# Altium project c195-group-9-vocast-pcb.PrjPcb (part 1 of 2)
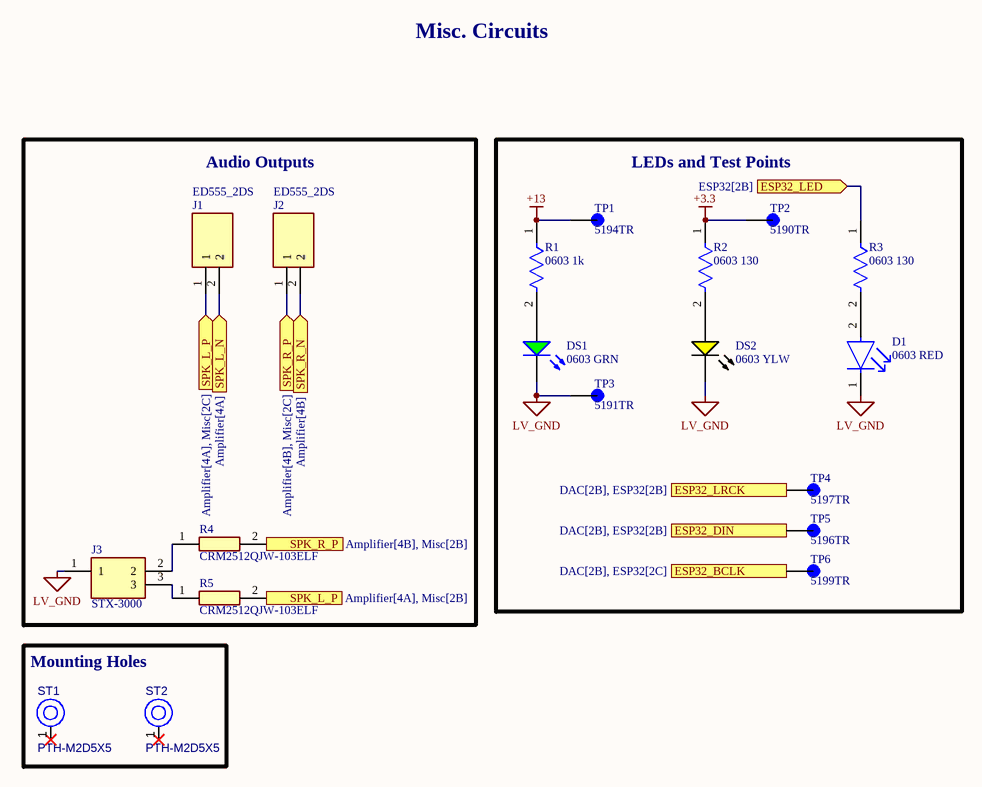
[diagram p0: Misc.SchDoc]
5 sheets, 141 parts. Net scope: flat (ports and power ports of the same name join across sheets).
Board file: Basestation.PcbDoc
Sheets:
  Misc.SchDoc
  Power.SchDoc
  ESP32.SchDoc
  DAC.SchDoc
  Amplifier.SchDoc

## Sheet Misc.SchDoc
size A; SheetNumber: 1; SheetTotal: 5

### Parts
D1  0603 RED  [FP-SML-LX0603IW-TR-MFG]
DS1  0603 GRN  [LUMX-SML-LX0603_V]
DS2  0603 YLW  [LUMX-SML-LX0603_V]
J1  ED555_2DS  [SHDR2W90P0X350_1X2_700X650X820P]
J2  ED555_2DS  [SHDR2W90P0X350_1X2_700X650X820P]
J3  STX-3000  [STX3000]
R1  0603 1k  [FP-CRCW0603-e3-MFG]
R2  0603 130  [FP-CRCW0603-e3-MFG]
R3  0603 130  [FP-CRCW0603-e3-MFG]
R4  CRM2512QJW-103ELF  [RESC6331X80N]
R5  CRM2512QJW-103ELF  [RESC6331X80N]
ST1  PTH-M2D5X5  [PTH-M2D5X5]
ST2  PTH-M2D5X5  [PTH-M2D5X5]
TP1  5194TR  [KEYSTONE_5194TR]
TP2  5190TR  [KEYSTONE_5190TR]
TP3  5191TR  [KEYSTONE_5191TR]
TP4  5197TR  [KEYSTONE_5197TR]
TP5  5196TR  [KEYSTONE_5196TR]
TP6  5199TR  [KEYSTONE_5199TR]

### Blocks framed on the sheet
Audio Outputs: J1-J3 R4 R5
LEDs and Test Points: D1 DS1 DS2 R1-R3 TP1-TP6
Mounting Holes: ST1 ST2

### Ports
ESP32_BCLK (see DAC[2B], ESP32[2C]), ESP32_DIN (see DAC[2B], ESP32[2B]), ESP32_LED (in, see ESP32[2B]), ESP32_LRCK (see DAC[2B], ESP32[2B]), SPK_L_N (in, see Amplifier[4A]), SPK_L_P (in, see Amplifier[4A], Misc[2B]), SPK_L_P (in, see Amplifier[4A], Misc[2C]), SPK_R_N (in, see Amplifier[4B]), SPK_R_P (in, see Amplifier[4B], Misc[2B]), SPK_R_P (in, see Amplifier[4B], Misc[2C])

### Nets
+3.3: R2.1 TP2.TP
+13: R1.1 TP1.TP  [project net TPA311_PVCCL]
LV_GND: D1.1(C) DS1.2(K) DS2.2(K) J3.1 TP3.TP  [project net TPA311_AGND]
NetC4_1: J1.1 R5.2 ; port SPK_L_P
NetC7_2: J1.2 ; port SPK_L_N
NetC10_1: J2.1 R4.2 ; port SPK_R_P
NetC11_2: J2.2 ; port SPK_R_N
NetD1_2: D1.2(A) R3.2
NetDS1_1: DS1.1(A) R1.2
NetDS2_1: DS2.1(A) R2.2
NetIC1_20: R3.1 ; port ESP32_LED
NetIC1_22: TP4.TP ; port ESP32_LRCK
NetIC1_23: TP5.TP ; port ESP32_DIN
NetIC1_24: TP6.TP ; port ESP32_BCLK
NetJ3_2: J3.2 R4.1
NetJ3_3: J3.3 R5.1

Not connected (* = marked no-connect by the designer): ST1 1(H1)*; ST2 1(H1)*

### Notes on the sheet
- Misc. Circuits

### Library data of the parts
D1 = CMP-57192-000012-1: LED RED DIFFUSED SMD; Luminous Intensity: 14mcd; Test Current: 20mA; Viewing Angle: 160°; Approvals: UL; Forward Voltage: 2V; Power Dissipation: 50mW; Dominant Wavelength: 635nm; Number of LEDs: 1; Lens Color: White; Height: 0.6mm; RoHS Compliant: Yes; Lead Free: Lead Free; Number of Pins: 2; Packaging: Tape and Reel; Case/Package: 0603; Length: 1.6mm; Color: Red; Max Operating Temperature: 85°C; Illumination Color: Red; Case Code (Metric): 1608; Diameter: 0.061inch; Min Operating Temperature: -25°C; Lens Style: Diffused; Mount: Surface Mount; Width: 0.8mm; Case Code (Imperial): 0603; Lens Transparency: Diffused; Wavelength: 635nm; Package Quantity: 1; Forward Current: 20mA
DS1 = CMP-2000-07120-1: LED Green Diode, 18 mcd, 50 mW, -25 to 85 degC, 2-Pin SMD, RoHS, Tape and Reel; Manufacturer: Lumex; Part No: SML-LX0603GW-TR; Peak Wavelength: 565nm; Viewing Angle: 160; LED Material: GaP; COO: CN; Lens Appearance: ColorlessDiffused; Pin_Count: 2; Type: Uni-Color; Intensity: 18mcd; Number of LEDs: 1; Reverse Voltage: 5(Min)V; Supplier: Lumex; ECCN: EAR99; Packaging: TapeandReel; Supplier Standard Pack: 4,000; Mounting: SurfaceMount; Operating Temperature: -25to85C; Package Description: 2-Pin Surface Mount Device, Body 1.6 x 0.8 mm; Family: SML-LX0603GW; Lens Dimensions: 1x0.8x0.3mm; Dominant Wavelength: N/A; Package Reference: SML-LX00603; HTS: 8541402000; Mounting Technology: SurfaceMount; Datasheet Version: Rev. G, 09/2013; Manufacturer URL: http://www.lumexinstruments.com/; RoHS: Yes; Datasheet URL: http://www.lumex.com/content/files/ProductAttachment/SML-LX0603GW-TR.pdf; Supplier_Package: SMD; Color: Green; Dimension: 1.6x0.8x0.6mm
DS2 = CMP-2000-07121-1: Yellow LED, Milky White Diffused Lens, 2.1 V, 14 mcd, -25 to 85 degC, 2-Pin SMD, RoHS, Tape and Reel; Manufacturer: Lumex; Part No: SML-LX0603YW-TR; COO: CN; Number of LEDs: 1; Type: Uni-Color; Intensity: 14mcd; Reverse Voltage: 5(Min)V; LED Material: GaAsP; Viewing Angle: 160; Peak Wavelength: 585nm; Pin_Count: 2; Lens Appearance: ColorlessDiffused; Operating Temperature: -25to85C; Color: Yellow; Mounting Technology: SurfaceMount; Package Description: 2-Pin Surface Mount Device, Body 1.6 x 0.8 mm; Mounting: SurfaceMount; Packaging: TapeandReel; RoHS: Unknown; Supplier_Package: SMD; Package Reference: SML-LX00603; Datasheet URL: http://www.lumex.com/content/files/ProductAttachment/SML-LX0603YW-TR.pdf; Dimension: 1.6x0.8x0.6mm; Manufacturer URL: http://www.lumexinstruments.com/; HTS: 8541402000; Datasheet Version: Rev. G, 09/2013; Lens Dimensions: 1x0.8x0.3mm; Dominant Wavelength: N/A; ECCN: EARII; Supplier: Lumex; Family: SML-LX0603YW
J1 J2 = ED555_2DS: Connector; Manufacturer_Name: On Shore Technology Inc.; Manufacturer_Part_Number: ED555/2DS; Datasheet Link: http://www.on-shore.com/wp-content/uploads/ED555XDS.pdf; Height: 8.2mm; Arrow Part Number: ED555/2DS; Arrow Price/Stock: https://www.arrow.com/en/products/ed5552ds/on-shore-technology?utm_currency=USD&region=nac
J3 = STX-3000: Connector; Manufacturer_Name: Kycon; Datasheet Link: http://www.kycon.com/Pub_Eng_Draw/STX-3000.pdf; Manufacturer_Part_Number: STX-3000; Mouser Part Number: 806-STX-3000; Mouser Price/Stock: https://www.mouser.co.uk/ProductDetail/Kycon/STX-3000?qs=kjZ2mQLP346Nbz1X9BOzfg%3D%3D
R1 = CMP-1666-00003-5: RES Thick Film, 1kΩ, 1%, 0.1W, 100ppm/°C, 0603; Max Power Dissipation: 100mW; Voltage Rating: 75V; Resistance: 1kR; Max Operating Temperature: 155°C; Number of Pins: 2; Case Code (Imperial): 0603; Width: 0.033inch; Power Rating: 100mW; Number of Terminations: 2; Package Quantity: 10; Weight: 7.1E-05oz; Tolerance: 1%; Temperature Coefficient: 100ppm/°C; Military Standard: Not; Mount: Surface Mount; Voltage Rating (DC): 75V; Depth: 0.85mm; Composition: Thick Film; Radiation Hardening: No; Termination: SMD/SMT; Length: 1.55mm; Case Code (Metric): 1608; Contact Plating: Tin; Min Operating Temperature: -55°C; Packaging: Tape and Reel; Height: 0.45mm; Lead Free: Lead Free; Case/Package: 0603; Features: Automotive AEC-Q200
R2 R3 = CMP-2000-03889-2: RES Thick Film, 130Ω, 1%, 0.1W, 100ppm/°C, 0603; Working Voltage: 75V; Power Rating: 100mW; Resistance: 130R; Depth: 0.85mm; Max Operating Temperature: 155°C; Width: 0.85mm; Composition: Thick Film; Radiation Hardening: No; Contact Plating: Tin; Tolerance: 1%; Number of Pins: 2; Length: 1.55mm; Case/Package: 0603; Features: Automotive AEC-Q200; Case Code (Metric): 1608; Min Operating Temperature: -55°C; Package Quantity: 10; Temperature Coefficient: 100ppm/°C; Packaging: Tape and Reel; Lead Free: Lead Free; Number of Terminations: 2; Voltage Rating (DC): 75V; Termination: SMD/SMT; Height: 0.45mm; Military Standard: Not; Max Power Dissipation: 100mW; Voltage Rating: 75V; Weight: 7.1E-05oz; Case Code (Imperial): 0603
R4 R5 = CRM2512QJW-103ELF: Resistor; Manufacturer_Name: Bourns; Datasheet Link: http://www.bourns.com/data/global/pdfs/CRM0805_1206_2010.pdf; Height: 0.8mm; Manufacturer_Part_Number: CRM2512QJW-103ELF; Mouser Part Number: 652-CRM2512QJW-103E; Mouser Price/Stock: https://www.mouser.co.uk/ProductDetail/Bourns/CRM2512QJW-103ELF?qs=8Wlm6%252BaMh8Rzg3bRHdWGsA%3D%3D; Arrow Part Number: CRM2512QJW-103ELF; Arrow Price/Stock: https://www.arrow.com/en/products/crm2512qjw-103elf/bourns?region=nac
ST1 ST2 = CMP-00028-00004-2: M2 PTH (2.5mm), 5mm pad; Pins: 1
TP1 = CMP-137-000011-1: Color Keyed SMT Test Point -Yellow; MF: Keystone Electronics; Design Item ID: 5194TR; Check_prices: https://www.snapeda.com/parts/5194TR/Keystone+Electronics/view-part/?ref=eda; MP: 5194TR; Source: 5194TR.SchLib; Value: *; SnapEDA_Link: https://www.snapeda.com/parts/5194TR/Keystone+Electronics/view-part/?ref=snap; Pin Count: 1; Package: None; Component Type: Standard
TP2 = CMP-137-000010-1: Color Keyed SMT Test Point -Red; MF: Keystone Electronics; Package: None; Check_prices: https://www.snapeda.com/parts/5190TR/Keystone+Electronics/view-part/?ref=eda; Design Item ID: 5190TR; Value: *; Component Type: Standard; Source: 5190TR.SchLib; MP: 5190TR; SnapEDA_Link: https://www.snapeda.com/parts/5190TR/Keystone+Electronics/view-part/?ref=snap; Pin Count: 1
TP3 = CMP-137-000007-1: Color Keyed SMT Test Point -Black; MF: Keystone Electronics; SnapEDA_Link: https://www.snapeda.com/parts/5191TR/Keystone+Electronics/view-part/?ref=snap; Component Type: Standard; Value: *; Source: 5191TR.SchLib; Design Item ID: 5191TR; Check_prices: https://www.snapeda.com/parts/5191TR/Keystone+Electronics/view-part/?ref=eda; Package: None; MP: 5191TR; Pin Count: 1
TP4 = CMP-137-000006-1: Color Keyed SMT Test Point - Blue; MF: Keystone Electronics; Value: *; SnapEDA_Link: https://www.snapeda.com/parts/5197TR/Keystone+Electronics/view-part/?ref=snap; Component Type: Standard; Design Item ID: 5197TR; MP: 5197TR; Pin Count: 1; Check_prices: https://www.snapeda.com/parts/5197TR/Keystone+Electronics/view-part/?ref=eda; Package: None; Source: 5197TR.SchLib
TP5 = CMP-137-000008-1: Color Keyed SMT Test Point -Green; MF: Keystone Electronics; Package: None; Pin Count: 1; MP: 5196TR; Value: *; Design Item ID: 5196TR; Component Type: Standard; Check_prices: https://www.snapeda.com/parts/5196TR/Keystone+Electronics/view-part/?ref=eda; Source: 5196TR.SchLib; SnapEDA_Link: https://www.snapeda.com/parts/5196TR/Keystone+Electronics/view-part/?ref=snap
TP6 = CMP-137-000009-1: Color Keyed SMT Test Point -Purple; MF: Keystone Electronics; Design Item ID: 5199TR; Check_prices: https://www.snapeda.com/parts/5199TR/Keystone+Electronics/view-part/?ref=eda; MP: 5199TR; Component Type: Standard; Pin Count: 1; Value: *; SnapEDA_Link: https://www.snapeda.com/parts/5199TR/Keystone+Electronics/view-part/?ref=snap; Source: 5199TR.SchLib; Package: None

## Sheet Power.SchDoc
size A3; SheetNumber: 2; SheetTotal: 5
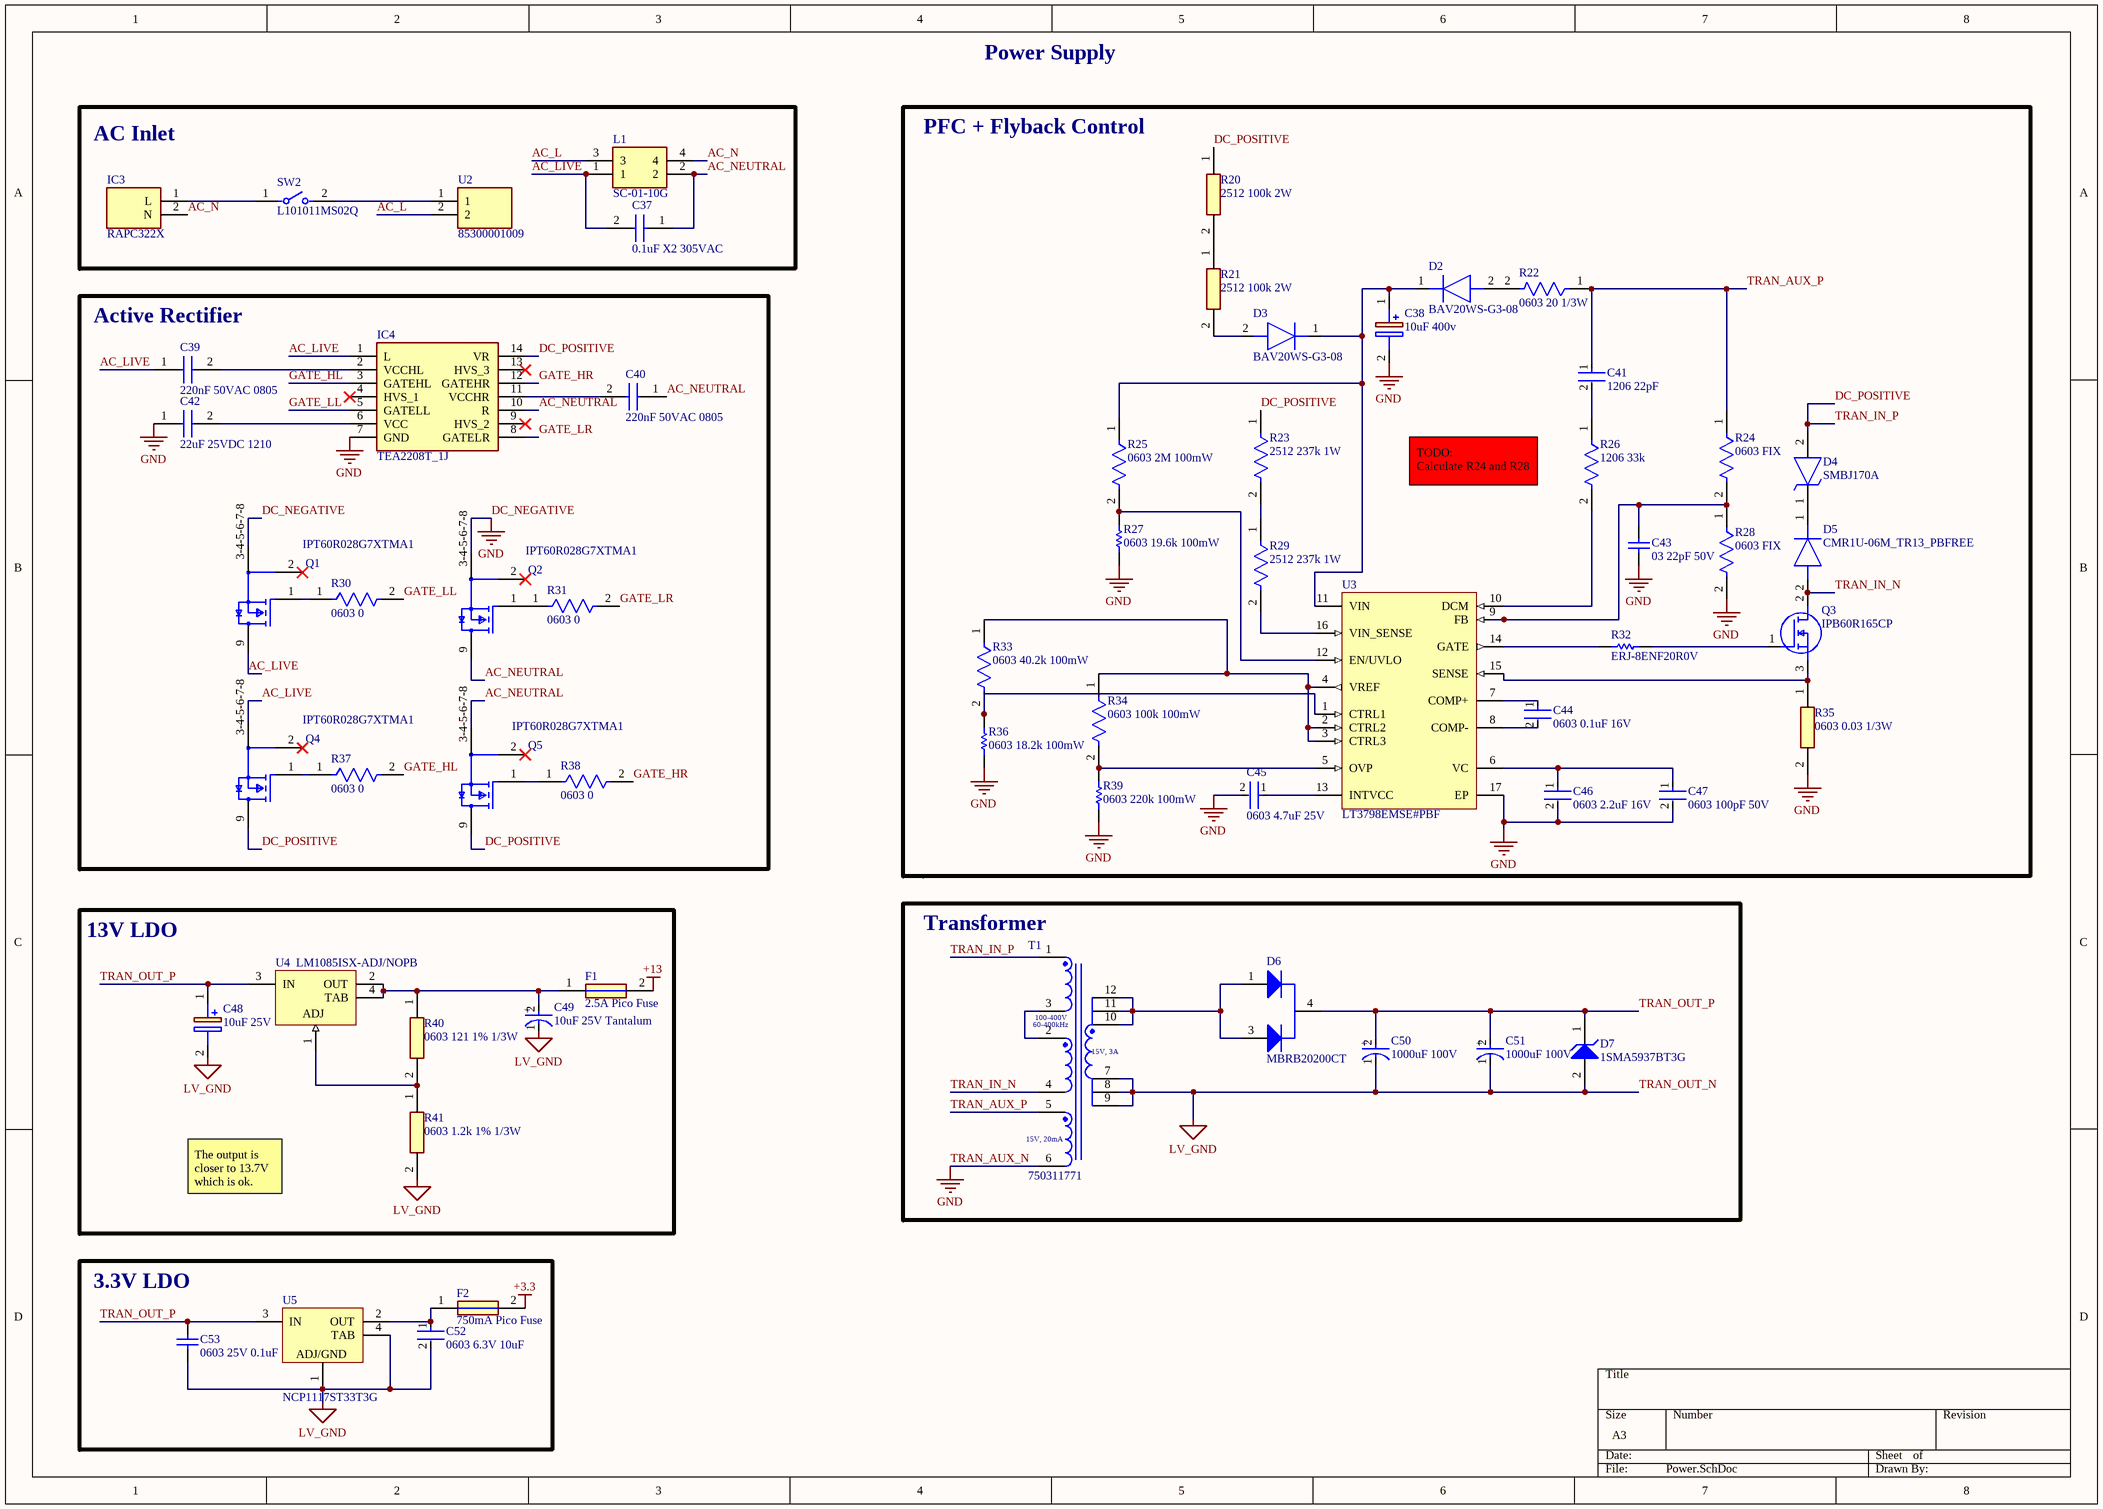
[diagram p1: Power.SchDoc]

### Parts
C37  0.1uF X2 305VAC  [B32922C_(18_x_5)]
C38  10uF 400v  [CAPPRD500W60D1025H2150]
C39  220nF 50VAC 0805  [CAPC2012X145N]
C40  220nF 50VAC 0805  [CAPC2012X145N]
C41  1206 22pF  [FP-C1206C-EB-MFG]
C42  22uF 25VDC 1210  [CAPC3225X200N]
C43  03 22pF 50V  [CAPC1608X90X35ML10T15]
C44  0603 0.1uF 16V  [FP-C0603C-CF-MFG]
C45  0603 4.7uF 25V  [FP-GRM188-0_15-IPC_C]
C46  0603 2.2uF 16V  [FP-C0603C225K4PACTU-MFG]
C47  0603 100pF 50V  [FP-C0603C-CF-MFG]
C48  10uF 25V  [CAPPRD200W55D500H1200]
C49  10uF 25V Tantalum  [FP-TAJB-MFG]
C50  1000uF 100V  [FP-RAD-TH-D_16_0_5-L_25_2-MFG]
C51  1000uF 100V  [FP-RAD-TH-D_16_0_5-L_25_2-MFG]
C52  0603 6.3V 10uF  [FP-GRM188-0_1-e0_2_0_55-IPC_A]
C53  0603 25V 0.1uF  [CAPC1608X87X35LL15T15]
D2  BAV20WS-G3-08  [SOD2713X115N]
D3  BAV20WS-G3-08  [SOD2713X115N]
D4  SMBJ170A  [DIOM5336X244N]
D5  CMR1U-06M_TR13_PBFREE  [DIOM5226X262N]
D6  MBRB20200CT  [ONSC-D2PAK-3-418B-04_V]
D7  1SMA5937BT3G  [ONSC-SMA-2-403D-02_F_V]
F1  2.5A Pico Fuse  [0251004MAT1L]
F2  750mA Pico Fuse  [0251004MAT1L]
IC3  RAPC322X  [RAPC322X]
IC4  TEA2208T_1J  [SOIC127P600X175-14N]
L1  SC-01-10G  [SC0110G]
Q1  IPT60R028G7XTMA1  [FP-PG-HSOF-8-MFG]
Q2  IPT60R028G7XTMA1  [FP-PG-HSOF-8-MFG]
Q3  IPB60R165CP  [IPB60R165CP]
Q4  IPT60R028G7XTMA1  [FP-PG-HSOF-8-MFG]
Q5  IPT60R028G7XTMA1  [FP-PG-HSOF-8-MFG]
R20  2512 100k 2W  [RESC6432X65N]
R21  2512 100k 2W  [RESC6432X65N]
R22  0603 20 1/3W  [FP-CRCW0603-HPe3-IPC_B]
R23  2512 237k 1W  [FP-CRCW2512-e3-IPC_B]
R24  0603 FIX  [FP-CRCW0603-HPe3-MFG]
R25  0603 2M 100mW  [FP-CRCW0603-e3-IPC_A]
R26  1206 33k  [FP-CRCW1206-e3-IPC_B]
R27  0603 19.6k 100mW  [RESC1609X50X30NL10T20]
R28  0603 FIX  [FP-CRCW0603-HPe3-MFG]
R29  2512 237k 1W  [FP-CRCW2512-e3-IPC_B]
R30  0603 0  [FP-ERJ-3GEY0R00V-MFG]
R31  0603 0  [FP-ERJ-3GEY0R00V-MFG]
R32  ERJ-8ENF20R0V  [RESC3216X70X50NL05T20]
R33  0603 40.2k 100mW  [FP-RC0603-0_55-IPC_C]
R34  0603 100k 100mW  [FP-RC0603-0_55-MFG]
R35  0603 0.03 1/3W  [ERJ3_B_BQ_BW_LW_(0603)]
R36  0603 18.2k 100mW  [RESC1608X55X30NL15T15]
R37  0603 0  [FP-ERJ-3GEY0R00V-MFG]
R38  0603 0  [FP-ERJ-3GEY0R00V-MFG]
R39  0603 220k 100mW  [RESC1608X55X25ML10T15]
R40  0603 121 1% 1/3W  [RESC1608X55N]
R41  0603 1.2k 1% 1/3W  [RESC1608X55N]
SW2  L101011MS02Q  [FP-L101011MS02Q-MFG]
T1  750311771  [WE-FB_EFD25]
U2  85300001009  [85300001009]
U3  LT3798EMSE#PBF  [LT-MSE-16-EDP_L]
U4  LM1085ISX-ADJ/NOPB  [KTT0003B_M]
U5  NCP1117ST33T3G  [ONSC-SOT-223-4-318H-01_A_V]

### Blocks framed on the sheet
AC Inlet: C37 IC3 L1 SW2 U2
Active Rectifier: C39 C40 C42 IC4 Q1 Q2 Q4 Q5 R30 R31 R37 R38
13V LDO: C48 C49 F1 R40 R41 U4
Transformer: C50 C51 D6 D7 T1
3.3V LDO: C52 C53 F2 U5

### Nets
+3.3: F2.2
+13: F1.2  [project net TPA311_PVCCL]
DC_NEGATIVE: C38.2(-) C42.1 C43.2 C45.2 C46.2 C47.2 IC4.7(GND) Q1.3-4-5-6-7-8(Source) Q2.3-4-5-6-7-8(Source) R27.1 R28.2 R35.2 R36.2 R39.2 T1.6 U3.17(EP)  [also labelled GND, TRAN_AUX_N]
LV_GND: C48.2(-) C49.1(C) C50.1(C) C51.1(C) C52.2 C53.2 D7.2(A) R41.2 T1.7 T1.8 T1.9 U5.1(ADJ/GND) U5.4(TAB)  [also labelled TRAN_OUT_N]  [project net TPA311_AGND]
AC_L: L1.3 U2.2
AC_LIVE: C37.2 C39.1 IC4.1(L) L1.1 Q1.9(Drain) Q4.3-4-5-6-7-8(Source)
AC_N: IC3.2(N) L1.4
AC_NEUTRAL: C37.1 C40.1 IC4.10(R) L1.2 Q2.9(Drain) Q5.3-4-5-6-7-8(Source)
DC_POSITIVE: D4.2(A) IC4.14(VR) Q4.9(Drain) Q5.9(Drain) R20.1 R23.1 T1.1  [also labelled TRAN_IN_P]
GATE_HL: IC4.3(GATEHL) R37.2
GATE_HR: IC4.12(GATEHR) R38.2
GATE_LL: IC4.5(GATELL) R30.2
GATE_LR: IC4.8(GATELR) R31.2
TRAN_AUX_P: C41.1 R22.1 R24.1 T1.5
TRAN_IN_N: D5.2(A) Q3.2(D) T1.4
TRAN_OUT_P: C48.1(+) C50.2(A) C51.2(A) C53.1 D6.4(K) D7.1(K) U4.3(IN) U5.3(IN)
NetC38_1: C38.1(+) D2.1(K) D3.1(K) R25.1 U3.11(VIN)
NetC39_2: C39.2 IC4.2(VCCHL)
NetC40_2: C40.2 IC4.11(VCCHR)
NetC41_2: C41.2 R26.1
NetC42_2: C42.2 IC4.6(VCC)
NetC43_1: C43.1 R24.2 R28.1 U3.9(FB)
NetC44_1: C44.1 U3.7(COMP+)
NetC44_2: C44.2 U3.8(COMP-)
NetC45_1: C45.1 U3.13(INTVCC)
NetC46_1: C46.1 C47.1 U3.6(VC)
NetC49_2: C49.2(A) F1.1 R40.1 U4.2(OUT) U4.4(TAB)
NetC52_1: C52.1 F2.1 U5.2(OUT)
NetD2_2: D2.2(A) R22.2
NetD3_2: D3.2(A) R21.2
NetD4_1: D4.1(K) D5.1(K)
NetD6_1: D6.1(A1) D6.3(A2) T1.10 T1.11 T1.12
NetIC3_1: IC3.1(L) SW2.1
NetQ1_1: Q1.1(Gate) R30.1
NetQ2_1: Q2.1(Gate) R31.1
NetQ3_1: Q3.1(G) R32.2
NetQ3_3: Q3.3(S) R35.1 U3.15(SENSE)
NetQ4_1: Q4.1(Gate) R37.1
NetQ5_1: Q5.1(Gate) R38.1
NetR20_2: R20.2 R21.1
NetR23_2: R23.2 R29.1
NetR25_2: R25.2 R27.2 U3.12(EN/UVLO)
NetR26_2: R26.2 U3.10(DCM)
NetR29_2: R29.2 U3.16(VIN_SENSE)
NetR32_1: R32.1 U3.14(GATE)
NetR33_1: R33.1 R34.1 U3.2(CTRL2) U3.3(CTRL3) U3.4(VREF)
NetR33_2: R33.2 R36.1 U3.1(CTRL1)
NetR34_2: R34.2 R39.1 U3.5(OVP)
NetR40_2: R40.2 R41.1 U4.1(ADJ)
NetSW2_2: SW2.2 U2.1
NetT1_2: T1.2 T1.3

Not connected (* = marked no-connect by the designer): IC4 4(HVS_1)* 9(HVS_2)* 13(HVS_3)*; Q1 2(Driver_Source)*; Q2 2(Driver_Source)*; Q4 2(Driver_Source)*; Q5 2(Driver_Source)*

### Notes on the sheet
- Power Supply
- PFC + Flyback Control
- TODO:
  Calculate R24 and R28
- The output is closer to 13.7V which is ok.
- (in symbol CMP-1360-00010-2) 100-400V; 60-400kHz; 15V, 3A; 15V, 20mA
- (in symbol CMP-04424-000481-1) +
- (in symbol CMP-05427-000487-1) +

### Library data of the parts
C37 = B32922C3104K289: Capacitor; Manufacturer_Name: TDK; Datasheet Link: https://product.tdk.com/system/files/dam/doc/product/capacitor/film/emi/data_sheet/20/20/db/fc_2009/x2_b32921_928.pdf; Manufacturer_Part_Number: B32922C3104K289; Mouser Part Number: 871-B32922C3104K289; Mouser Price/Stock: https://www.mouser.co.uk/ProductDetail/EPCOS-TDK/B32922C3104K289?qs=w5o0Loj0u7OxRKa1IZTr8g%3D%3D; Arrow Part Number: B32922C3104K289; Arrow Price/Stock: https://www.arrow.com/en/products/b32922c3104k289/tdk?utm_currency=USD&region=nac
C38 = UCS2G100MPD1TD: Capacitor Polarised; Manufacturer_Name: Nichicon; Datasheet Link: http://nichicon-us.com/english/products/pdfs/e-ucs.pdf; Height: 21.5mm; Manufacturer_Part_Number: UCS2G100MPD1TD; Mouser Part Number: 647-UCS2G100MPD1TD; Mouser Price/Stock: https://www.mouser.co.uk/ProductDetail/Nichicon/UCS2G100MPD1TD?qs=qJYTfuAnAfodP803qrfaZA%3D%3D; Arrow Part Number: UCS2G100MPD1TD; Arrow Price/Stock: https://www.arrow.com/en/products/ucs2g100mpd1td/nichicon?region=nac
C39 C40 = AC0805KFX7R9BB224: Capacitor; Manufacturer_Name: KEMET; Datasheet Link: http://www.yageo.com/documents/recent/UPY-AC_NP0X7R_16V-to-630V_12.pdf; Height: 1.45mm; Manufacturer_Part_Number: AC0805KFX7R9BB224
C41 = CMP-1037-00989-2: CAP CER 22PF 100V 5% NP0 1206; Manufacturer Part Number: C1206C220J1GACTU; Manufacturer: KEMET; Material: Ceramic; Automotive Grade: Grade 0; Tolerance: 0.05; Temperature Characteristic: C0G; Temperature Coefficient: 15%; Capacitance: 22 pF; Value: 22 pF; Mouser Description: 1206 22pF Ceramic Multilayer Capacitor; 100VDC; 125degC; C0G Dielec; +/-5% SMD; ComponentLink2Description: Datasheet; Digikey Description: CAP CER 22PF 100V 5% NP0 1206; Automotive: Yes; Temperature: -55°C to +150°C; Lead Free: Yes; Height: 0.88mm; Device Class L3: Ceramic Capacitors; Ipc Land Pattern Name: CAPC320160X78; ComponentLink2URL: https://content.kemet.com/datasheets/KEM_C1007_X8R_ULTRA_150C_SMD.pdf; Temperature Range High: +150°C; Device Class L1: Passive Components; Temperature Range Low: -55°C; Voltage Rating: 100 V; Category: Cap; Device Class L2: Capacitors; Octopart: https://octopart.com/c1206c220j1gactu-kemet-9145181; RoHS: TRUE; Package: C1206C-EB
C42 = 25MU225MB23225: Capacitor; Manufacturer_Name: Rubycon; Datasheet Link: http://www.rubycon.co.jp/en/catalog/e_pdfs/pmlcap/e_MU.pdf; Height: 2mm; Manufacturer_Part_Number: 25MU225MB23225; Mouser Part Number: 232-25MU225MB23225; Mouser Price/Stock: https://www.mouser.co.uk/ProductDetail/Rubycon/25MU225MB23225?qs=T3oQrply3y80th0zXFlwOw%3D%3D
C43 = CMP-2000-04945-1: Chip Capacitor, 22 pF, +/- 5%, 50 V, -55 to 125 degC, 0603 (1608 Metric), RoHS, Tape and Reel; Manufacturer: Murata; Dielectric: C0G; Capacitance: 22pF; Manufacturer URL: http://www.murata.com/; Datasheet Version: Jul-06; Package Reference: 603; Tolerance (%): ±5%; Case Size/Dimension: 0603; Rated Voltage: 50V; Package Description: 2-Pin Surface Mount Device, Body 1.6 x 0.8 mm; Datasheet URL: https://datasheet.ciiva.com/11786/0900766b807a1cab-11786398.pdf
C44 = CMP-2006-03061-2: CAP CER 0.1UF 50V X7R 0603; Manufacturer: KEMET; Manufacturer Part Number: C0603C104K5RACTU; Tolerance: 0.1; Temperature Coefficient: 30ppm/°C; Material: Ceramic; Automotive Grade: Grade 1; Value: 0.10 μF; Temperature: -55°C to +125°C; RoHS: TRUE; Temperature Range High: +125°C; Lead Free: Yes; Octopart: https://octopart.com/c0603c104k5ractu-kemet-139244; Digikey Description: CAP CER 0.1UF 50V X7R 0603; Category: Cap; Package: C0603C-CF; ComponentLink2Description: Datasheet; Temperature Range Low: -55°C; Device Class L1: Passive Components; Voltage Rating: 50 V; Automotive: Yes; Device Class L3: Ceramic Capacitors; ComponentLink2URL: https://api.kemet.com/component-edge/download/datasheet/C0603C100J5GACAUTO.pdf; Capacitance: 0.10 μF; Device Class L2: Capacitors; Temperature Characteristic: X7R; Height: 0.87mm
C45 = CMP-2006-02523-2: Chip Multilayer Ceramic Capacitors for General Purpose, 0603, 4.7uF, X5R, 15%, 10%, 25V; Case Code (Metric): 1608; Max Operating Temperature: 85°C; REACH SVHC: No SVHC; Voltage Rating: 25V; Dielectric: X5R; Packaging: Cut Tape; Width: 0.031inch; Min Operating Temperature: -55°C; Lead Free: Lead Free; Capacitance: 4.7uF; Height: 0.8mm; Case Code (Imperial): 0603; Length: 1.6mm; Voltage Rating (DC): 25V; Case/Package: 0603; Voltage: 25V; Tolerance: 10%; Thickness: 0.031inch; Mount: Surface Mount; Material: Ceramic; Package Quantity: 4000; Depth: 0.8mm
C46 = CMP-2006-02259-2: CAP CER 2.2UF 16V X5R 0603; Dielectric Material: Ceramic; Tolerance: 10%; Dissipation Factor: 5%; Series: C; Voltage Rating (DC): 16V; REACH SVHC: No SVHC; RoHS Compliant: Yes; Number of Pins: 2; Max Operating Temperature: 85°C; Voltage Rating: 16V; Min Operating Temperature: -55°C; Termination: SMD/SMT; Dielectric: X5R; Packaging: Tape and Reel; Contact Plating: Tin; Case Code (Metric): 1608; Height: 0.8mm; Capacitance: 2.2uF; Case/Package: 0603; Width: 0.8mm; Construction: Flat; Depth: 0.8mm; Thickness: 0.034inch; Radiation Hardening: No; Length: 1.6mm; Mount: Surface Mount; Case Code (Imperial): 0603; Voltage: 16V; Package Quantity: 1; Lead Free: Lead Free
C47 = CMP-2006-03408-2: CAP CER 100PF 50V C0G/NP0 0603; Manufacturer Part Number: C0603C101J5GACTU; Manufacturer: KEMET; Material: Ceramic; Tolerance: 0.05; Automotive Grade: Grade 1; Temperature Coefficient: 30ppm/°C; Temperature Characteristic: C0G; RoHS: TRUE; Temperature Range Low: -55°C; Automotive: Yes; Digikey Description: CAP CER 100PF 50V C0G/NP0 0603; Voltage Rating: 50 V; Lead Free: Yes; Category: Cap; Device Class L3: Ceramic Capacitors; Mouser Description: Multilayer Ceramic Capacitor, C Series, 100 Pf, - 5%, C0g / Np0, 50 V, 0603 [1608 Metric] Rohs Compliant: Yes; Value: 100 pF; Device Class L1: Passive Components; Temperature: -55°C to +125°C; ComponentLink2URL: https://api.kemet.com/component-edge/download/datasheet/C0603C100J5GACAUTO.pdf; Temperature Range High: +125°C; ComponentLink2Description: Datasheet; Octopart: https://octopart.com/c0603c101j5gactu-kemet-100052; Device Class L2: Capacitors; Height: 0.87mm; Capacitance: 100 pF; Package: C0603C-CF
C48 = ECA-1EM100: Capacitor Polarised; Manufacturer_Name: Panasonic; Datasheet Link: https://componentsearchengine.com/Datasheets/2/ECA-1EM100.pdf; Height: 12mm; Manufacturer_Part_Number: ECA-1EM100; Mouser Part Number: 667-ECA-1EM100; Mouser Price/Stock: https://www.mouser.com/Search/Refine.aspx?Keyword=667-ECA-1EM100; Arrow Part Number: ECA-1EM100; Arrow Price/Stock: https://www.arrow.com/en/products/eca1em100/panasonic
C49 = CMP-04424-000481-1: 10uF 25V  ±10% 2.5Ω 1210  SMD Tantalum Capacitor; ESR (Equivalent Series Resistance): 2.5R; Polarity: Polar; Dissipation Factor: 6%; Leakage Current: 2.5uA; Lead Free: Lead Free; Capacitance: 10uF; Voltage Rating: 25V; Mount: Surface Mount; Packaging: Tape and Reel; Min Operating Temperature: -55°C; Weight: 0.000564oz; Series: TAJ; Case/Package: 1210; Width: 0.11inch; Height - Seated (Max): 0.083inch; RoHS Compliant: Yes; Height: 2.1mm; Depth: 2.8mm; Radiation Hardening: No; Construction: Flat; Max Operating Temperature: 125°C; Voltage Rating (DC): 25V; Features: General Purpose; REACH SVHC: No SVHC; Tolerance: 10%; Package Quantity: 1; Case Code (Metric): 3528; Termination: SMD/SMT; Case Code (Imperial): 1210; Length: 3.5mm
C50 C51 = CMP-05427-000487-1: Aluminum Electrolytic Capacitors (Radial Lead Type) 1000uF ±20% 50V; Ripple Current: 3.32A; Impedance: 16mR; Polarity: Polar; Life (Hours): 10000Hour; Capacitance: 1mF; Lead Diameter: 0.8mm; Mount: Through Hole; Series: FR; Package Quantity: 250; Length: 25mm; Radiation Hardening: No; REACH SVHC: No SVHC; Case/Package: Radial; Height: 25mm; Min Operating Temperature: -40°C; Contact Plating: Tin; Lead Free: Lead Free; Height - Seated (Max): 0.984inch; RoHS Compliant: Yes; Features: General Purpose; ESR (Equivalent Series Resistance): 16mR; Voltage Rating: 50V; Diameter: 16mm; Voltage Rating (DC): 50V; Max Operating Temperature: 105°C; Lead Pitch: 7.5mm; Packaging: Tape and Reel; Number of Pins: 2; Tolerance: 20%; Termination: Through Hole
C52 = CMP-2006-02792-2: Chip Multilayer Ceramic Capacitors for General Purpose, 0603, 10uF, X5R, 15%, 20%, 6.3V; Packaging: Tape and Reel; Voltage Rating (DC): 6.3V; Width: 0.031inch; Termination: SMD/SMT; Dielectric: X5R; Package Quantity: 4000; Voltage Rating: 6.3V; Capacitance: 10uF; Case/Package: 0603; Min Operating Temperature: -55°C; Voltage: 6.3V; Length: 1.6mm; Thickness: 0.035inch; Lead Free: Lead Free; Depth: 0.8mm; Case Code (Imperial): 0603; Max Operating Temperature: 85°C; Material: Ceramic; Height: 0.8mm; Tolerance: 20%; Mount: Surface Mount; REACH SVHC: No SVHC; Radiation Hardening: No; Case Code (Metric): 1608
C53 = CMP-2006-03713-1: Part Number: C0603C105K3RACTU; Manufacturer: Kemet
D2 D3 = BAV20WS-G3-08: Diode; Manufacturer_Name: Vishay; Datasheet Link: https://componentsearchengine.com/Datasheets/1/BAV20WS-G3-08.pdf; Height: 1.15mm; Manufacturer_Part_Number: BAV20WS-G3-08; Mouser Part Number: 78-BAV20WS-G3-08; Mouser Price/Stock: https://www.mouser.co.uk/ProductDetail/Vishay-Semiconductors/BAV20WS-G3-08?qs=ROh%252BA47s9d2Jk9K4pPeq%252BQ%3D%3D; Arrow Part Number: BAV20WS-G3-08; Arrow Price/Stock: https://www.arrow.com/en/products/bav20ws-g3-08/vishay?region=nac
D4 = SMBJ170A: TVS Diode (Uni-directional); Manufacturer_Name: HY Electronic; Height: 2.44mm; Manufacturer_Part_Number: SMBJ170A
D5 = CMR1U-06M_TR13_PBFREE: Diode; Manufacturer_Name: Central Semiconductor; Manufacturer_Part_Number: CMR1U-06M TR13 PBFREE; Datasheet Link: https://my.centralsemi.com/datasheets/CMR1U01M.PDF; Height: 2.62mm; Mouser Part Number: 610-CMR1U-06M; Mouser Price/Stock: https://www.mouser.co.uk/ProductDetail/Central-Semiconductor/CMR1U-06M-TR13-PBFREE/?qs=u16ybLDytRaiTbcu0RAPhw%3D%3D
D6 = CMP-1055-00130-1: SWITCHMODE(TM) Power Rectifier, Dual Schottky Rectifiers, 3-Pin D2PAK, Tube; Manufacturer: On Semiconductor; Note1: 0; IFSM Max (A): 150; Configuration: Common Cathode; ComponentLink2Description: Datasheet; ComponentLink3Description: Package Specification; ComponentLink3URL: http://www.onsemi.com/pub_link/Collateral/418B-04.PDF; ComponentLink1URL: http://www.onsemi.com/; PackageReference: D2PAK-3-418B-04; ComponentLink2URL: http://www.onsemi.cn/pub_link/Collateral/MBRB20200CT-D.PDF; DatasheetVersion: Rev. 7; Mounting Technology: Surface Mount; Packing: Tube; PackageVersion: Rev. K, 09/2008; PackageDescription: 3-Pin Flange Mount, Body 9.145 x 9.97 mm, Pitch 2.54 mm; ComponentLink1Description: Manufacturer URL; PartNumber: MBRB20200CT; RoHS: FALSE
D7 = CMP-1060-00094-1: 1.5 W Zener Voltage Regulator, 2-Pin SMA, Pb-Free, Tape and Reel; Manufacturer: On Semiconductor; VZ Typ (V): 33; ComponentLink1URL: http://www.onsemi.com/; PartNumber: 1SMA5937BT3G; ComponentLink3URL: http://www.onsemi.com/pub_link/Collateral/1SMA5913BT3-D.PDF; ComponentLink2URL: http://www.onsemi.com/pub_link/Collateral/1SMA5913BT3-D.PDF; RoHS: Pb-Free; ComponentLink2Description: Datasheet; Packing: Tape and Reel; ComponentLink1Description: Manufacturer URL; PackageReference: SMA-2-403D-02_F; ComponentLink3Description: Package Specification; DatasheetVersion: Rev. 8; PackageDescription: 2-Pin Small Molded Package, J-Bend Lead, Body 2.605 x 4.315 mm; Mounting Technology: Surface Mount; PackageVersion: Rev. F, 11/2008
F1 F2 = 0251004.MAT1L: Fuse; Manufacturer_Name: LITTELFUSE; Datasheet Link: https://www.littelfuse.com/media?resourcetype=datasheets&itemid=f47a0bb7-8ede-4679-9646-7114c3787688&filename=littelfuse-fuse-251-253-datasheet; Height: 2.8mm; Manufacturer_Part_Number: 0251004.MAT1L; Mouser Part Number: 576-0251004.MAT1L; Mouser Price/Stock: https://www.mouser.co.uk/ProductDetail/Littelfuse/0251004.MAT1L?qs=vco6xy%252BeH1onbv8s0e1iMg%3D%3D; Arrow Part Number: 0251004.MAT1L; Arrow Price/Stock: https://www.arrow.com/en/products/0251004.mat1l/littelfuse?utm_currency=USD&region=nac
IC3 = RAPC322X: Integrated Circuit; Manufacturer_Name: Switchcraft; Datasheet Link: http://www.switchcraft.com/Drawings/RAPC322X_CD.PDF; Height: 13mm; Manufacturer_Part_Number: RAPC322X; Mouser Part Number: 502-RAPC322X; Mouser Price/Stock: https://www.mouser.co.uk/ProductDetail/Switchcraft/RAPC322X?qs=mcPJWgAPNrcmmHrLtKpxWA%3D%3D; Arrow Part Number: RAPC322X; Arrow Price/Stock: https://www.arrow.com/en/products/rapc322x/switchcraft?region=nac
IC4 = TEA2208T_1J: Integrated Circuit; Manufacturer_Name: NXP; Manufacturer_Part_Number: TEA2208T/1J; Datasheet Link: https://www.nxp.com/docs/en/data-sheet/TEA2208T.pdf; Height: 1.75mm; Mouser Part Number: 771-TEA2208T/1J; Mouser Price/Stock: https://www.mouser.co.uk/ProductDetail/NXP-Semiconductors/TEA2208T-1J?qs=wnTfsH77Xs7i9IS7OBVq2w%3D%3D
L1 = SC-01-10G: Inductor; Manufacturer_Name: KEMET; Datasheet Link: https://content.kemet.com/datasheets/KEM_LF0011_SC-G-GS.pdf; Height: 23mm; Manufacturer_Part_Number: SC-01-10G; Mouser Part Number: 80-SC-01-10G; Mouser Price/Stock: https://www.mouser.co.uk/ProductDetail/KEMET/SC-01-10G?qs=BenOyfdfArpzDVRBtNEKMw%3D%3D
Q1 Q2 Q4 Q5 = CMP-32901-000081-1: MOSFET N-CH 600V 75A HSOF-8; Manufacturer: Infineon; Turn On Delay Time: 28ns; Drain To Source Voltage: 650V; Typ Forward Diode Voltage: 0.8V; Input Capacitace At Vds: 4820pF @ 400V; Number Of Channels: 1; Reverse Recovery Time: 440ns; Depletion Mode: False; Pulse Drain Current: 245A; Turn Off Delay Time: 100ns; Max Junction Temp: +150°C; Threshold Vgs Min: 3V; Power Dissipation: 391W; Drain To Source Resistance: 0.024Ω; Threshold Vgs Max: 4V; Rthja Max: 62°C/W; Gate Charge At Vgs: 123nC @ 10V; Gate To Source Voltage: 20V; Reverse Recovery Charge: 8700nC; ComponentLink2Description: Datasheet; RoHS: TRUE; Device Class L1: Discrete Semiconductors; ComponentLink2URL: https://www.infineon.com/dgdl/Infineon-IPT60R028G7-DS-v02_00-EN.pdf?fileId=5546d46259d9a4bf015a13e82df70e30; Temperature Range High: +150°C; Temperature Range Low: -55°C; Number Of N Channels: 1; Automotive: No; Footprint Url: https://www.infineon.com/cms/en/product/packages/PG-HSOF/PG-HSOF-8-2/; Continuous Drain Current: 75A; Package: PG-HSOF-8; Category: Trans; Height: 2.4mm; Device Class L3: MOSFETs; Mouser Description: Trans MOSFET N-CH 600V 75A 9-Pin(8+Tab) HSOF T/R; Device Class L2: Transistors; Lead Free: Yes; Digikey Description: MOSFET N-CH 600V 75A HSOF-8; Octopart: https://octopart.com/ipt60r028g7xtma1-infineon-76958210; Manufacturer Part Number: IPT60R028G7XTMA1; Temperature: -55°C to +150°C; Drain To Source Breakdown Voltage: 600V
Q3 = IPB60R165CP: MOSFET (N-Channel); Manufacturer_Name: Infineon; Datasheet Link: https://www.infineon.com/dgdl/Infineon-IPB60R165CP-DS-v02_01-en.pdf?fileId=db3a304412b407950112b42dd38f48fc; Height: 4.826mm; Manufacturer_Part_Number: IPB60R165CP; Mouser Part Number: 726-IPB60R165CP; Mouser Price/Stock: https://www.mouser.co.uk/ProductDetail/Infineon-Technologies/IPB60R165CP?qs=mzcOS1kGbgdcrfUvmAosLQ%3D%3D
R20 R21 = 9-2176070-7: Resistor; Manufacturer_Name: TE Connectivity; Datasheet Link: https://www.te.com/commerce/DocumentDelivery/DDEController?Action=srchrtrv&DocNm=9-1773463-5&DocType=Data+Sheet&DocLang=English&PartCntxt=9-2176070-7&DocFormat=pdf; Height: 0.65mm; Manufacturer_Part_Number: 9-2176070-7; Mouser Part Number: 279-9-2176070-7; Mouser Price/Stock: https://www.mouser.co.uk/ProductDetail/TE-Connectivity-Holsworthy/9-2176070-7/?qs=IXkKOuu5vnGY%252Bze3ajKOBA%3D%3D
R22 = CMP-2000-03074-2: RES Thick Film, 20Ω, 1%, 0.33W, 100ppm/°C, 0603; Max Power Dissipation: 250mW; Resistance: 20R; Voltage Rating: 75V; Lead Free: Lead Free; Depth: 0.85mm; Temperature Coefficient: 100ppm/°C; Width: 0.033inch; Case Code (Metric): 1608; Case/Package: 0603; Radiation Hardening: No; Number of Terminations: 2; Features: Automotive AEC-Q200; Packaging: Tape and Reel; Min Operating Temperature: -55°C; Max Operating Temperature: 155°C; Mount: Surface Mount; Composition: Thick Film; Contact Plating: Tin; Height: 0.45mm; Power Rating: 250mW; Tolerance: 1%; Termination: Wraparound; Weight: 7.1E-05oz; Case Code (Imperial): 0603; Length: 1.6mm; Package Quantity: 10
R23 R29 = CMP-02407-005674-1: RES Thick Film, 237kΩ, 1%, 1W, 100ppm/°C, 2512; Resistance: 237kR; Voltage Rating (DC): 500V; Package Quantity: 2000; Case Code (Metric): 6432; Max Power Dissipation: 1W; Temperature Coefficient: 100ppm/°C; Case Code (Imperial): 2512; Composition: Thick Film; Height: 0.028inch; Width: 0.124inch; Case/Package: 2512; Lead Free: Lead Free; Packaging: Tape and Reel; Tolerance: 1%; Features: Automotive AEC-Q200; Length: 0.248inch; Number of Terminations: 2
R24 R28 = CMP-2000-03817-2: RES Thick Film, 0Ω, , 0.33W, , 0603; Max Power Dissipation: 250mW; Voltage Rating (DC): 75V; Temperature Coefficient: 0ppm/°C; Resistance: 0mR; Mount: Surface Mount; Package Quantity: 5000; Features: Automotive AEC-Q200; Length: 1.6mm; Width: 0.033inch; Min Operating Temperature: -55°C; Max Operating Temperature: 155°C; Contact Plating: Tin; Depth: 0.85mm; Case/Package: 0603; Radiation Hardening: No; Military Standard: Not; Power Rating: 250mW; Height: 0.45mm; Composition: Thick Film; Lead Free: Lead Free; Voltage Rating: 75V; Case Code (Imperial): 0603; Weight: 7.1E-05oz; Number of Terminations: 2; Packaging: Tape and Reel; Number of Pins: 2; Case Code (Metric): 1608; Termination: SMD/SMT
R25 = CMP-2000-03189-2: RES Thick Film, 2MΩ, 1%, 0.1W, 100ppm/°C, 0603; Resistance: 2MR; Voltage Rating (DC): 75V; Packaging: Tape and Reel; Temperature Coefficient: 100ppm/°C; Width: 0.033inch; Depth: 0.85mm; Contact Plating: Tin; Max Power Dissipation: 100mW; Length: 1.55mm; Military Standard: Not; Features: Automotive AEC-Q200; Number of Pins: 2; Radiation Hardening: No; Case Code (Imperial): 0603; Weight: 7.1E-05oz; Case Code (Metric): 1608; Max Operating Temperature: 155°C; Voltage Rating: 75V; Number of Terminations: 2; Case/Package: 0603; Min Operating Temperature: -55°C; Composition: Thick Film; Height: 0.45mm; Tolerance: 1%; Package Quantity: 10; Termination: SMD/SMT; Working Voltage: 75V; Power Rating: 100mW; Lead Free: Lead Free
R26 = CMP-2003-02103-2: RES Thick Film, 33kΩ, 1%, 0.25W, 100ppm/°C, 1206; Working Voltage: 200V; Resistance: 33kR; Power Rating: 250mW; Package Quantity: 10; Max Operating Temperature: 155°C; Height: 0.55mm; Length: 3.2mm; Lead Free: Lead Free; Contact Plating: Tin; Min Operating Temperature: -55°C; Voltage Rating (DC): 200V; Case Code (Metric): 3216; Depth: 1.6mm; Voltage Rating: 200V; Tolerance: 1%; Weight: 0.000353oz; Termination: SMD/SMT; Composition: Thick Film; Military Standard: Not; Features: Automotive AEC-Q200; Case Code (Imperial): 1206; Case/Package: 1206; Number of Terminations: 2; Packaging: Tape and Reel; Temperature Coefficient: 100ppm/°C; Width: 1.6mm; Max Power Dissipation: 250mW; Radiation Hardening: No
R27 = CMP-2000-02969-1: Manufacturer: Vishay Dale; Part Number: CRCW060319K6FKEA
R30 R31 R37 R38 = CMP-2000-00700-2: RES SMD 0 OHM JUMPER 1/10W 0603; Manufacturer Part Number: ERJ-3GEY0R00V; Manufacturer: Panasonic; Tolerance: 5%; Automotive Grade: Grade 0; Voltage Rating: 75V; Value: 0Ω; Temperature Coefficient: -100/+600ppm/°C; Power Rating: 0.1W; Mouser Description: Resistor, Chip Thick Film, 0 Ohm, 0.1w, Resistor, Chip Thick Film, 0 Ohm, 0.1w, 5%; Ipc Land Pattern Name: RESC16080X45; Category: Res; Package: 0603; Temperature: -55°C to +155°C; Temperature Range Low: -55°C; Series: ERJ; Resistance: 0Ω; RoHS: TRUE; Composition: Thick Film; Octopart: https://octopart.com/erj-3gey0r00v-panasonic-55389238; Device Class L1: Passive Components; Footprint Url: https://industrial.panasonic.com/cdbs/www-data/pdf/RDA0000/DMA0000COL17.pdf; ComponentLink2Description: Datasheet; Device Class L2: Resistors; Temperature Range High: +155°C; Digikey Description: RES SMD 0 OHM JUMPER 1/10W 0603; Lead Free: Yes; Device Class L3: Chip SMD Resistors; Height: 0.55mm; ComponentLink2URL: https://industrial.panasonic.com/cdbs/www-data/pdf/RDA0000/AOA0000C301.pdf; Automotive: Yes
R32 = CMP-2003-00203-1: Manufacturer: Panasonic; Part Number: ERJ-8ENF20R0V
R33 = CMP-03412-037816-1: RES 40.2K OHM 1% 1/10W 0603; Resistance: 40.2kR; Voltage Rating: 50V; Working Voltage: 75V; Temperature Coefficient: 100ppm/°C; Construction: Rectangular; RoHS Compliant: Yes; Military Standard: Not; Min Operating Temperature: -55°C; Resistor Type: Thick Film; Depth: 0.8mm; Features: Moisture Resistant; Power Rating: 100mW; Case Code (Imperial): 0603; Number of Terminations: 2; Series: RC; Width: 0.8mm; Height: 0.45mm; Packaging: Tape and Reel; Length: 1.6mm; Case Code (Metric): 1608; Termination: SMD/SMT; Max Operating Temperature: 155°C; Voltage Rating (DC): 50V; Max Power Dissipation: 100mW; Tolerance: 1%; Case/Package: 0603; Lead Free: Lead Free; Technology: METAL OXIDE FILM; Mount: Surface Mount
R34 = CMP-2100-03662-2: RES SMD 100K OHM 1% 1/10W 0603; Voltage Rating (DC): 50V; Resistance: 100kR; Temperature Coefficient: 100ppm/°C; Working Voltage: 75V; Length: 1.6mm; Lead Free: Lead Free; Number of Terminations: 2; Packaging: Tape and Reel; Voltage Rating: 50V; Termination: SMD/SMT; Width: 0.8mm; Resistor Type: Thick Film; Max Power Dissipation: 100mW; Resistance Tolerance: 1%; Features: Moisture Resistant; Height: 0.45mm; Construction: Rectangular; Case/Package: 0603; Military Standard: Not; Case Code (Imperial): 0603; Series: RC; Technology: THICK FILM; Depth: 0.8mm; RoHS Compliant: Yes; REACH SVHC: No SVHC; Min Operating Temperature: -55°C; Case Code (Metric): 1608; Max Operating Temperature: 155°C; Power Rating: 100mW; Number of Pins: 2; Tolerance: 1%
R35 = ERJ-3BWFR030V: Resistor; Manufacturer_Name: Panasonic; Datasheet Link: http://industrial.panasonic.com/cdbs/www-data/pdf/RDN0000/AOA0000C313.pdf; Manufacturer_Part_Number: ERJ-3BWFR030V; Mouser Part Number: 667-ERJ-3BWFR030V; Mouser Price/Stock: https://www.mouser.co.uk/ProductDetail/Panasonic/ERJ-3BWFR030V?qs=ob%252BdNz2%252BYEgeP2PEealD%252Bg%3D%3D
R36 = CMP-2000-00300-1: Part Number: ERJ-3EKF1822V; Manufacturer: Panasonic
R39 = CMP-1659-00037-1: Chip Resistor, 220 KOhm, +/- 1%, 100 mW, -55 to 155 degC, 0603 (1608 Metric), RoHS, Tape and Reel; Resistance: 0.1 Ohm; ComponentLink1Description: Manufacturer URL; ComponentLink2Description: Datasheet; ComponentLink1URL: http://www.yageo.com/; REACH SVHC: No SVHC; RoHSCompliant: true; DatasheetVersion: Rev. 4, 02/2016; Min Operating Temperature: -25 degC; Height: 0.25 inch; ComponentLink2URL: http://www.yageo.com/documents/recent/PYu-RC_Group_51_RoHS_L_04.pdf; PackageDescription: 2-Pin Surface Mount Device, Body 1.6 x 0.8 mm; Max Operating Temperature: 70 degC; Width: 0.25 inch; Length: 0.75 inch; PackageReference: 0603
R40 = CRCW0603121RFKEAHP: Resistor; Manufacturer_Name: Vishay; Datasheet Link: https://www.vishay.com/docs/20043/crcwhpe3.pdf; Height: 0.55mm; Manufacturer_Part_Number: CRCW0603121RFKEAHP; Mouser Part Number: 71-CRCW0603121RFKEAH; Mouser Price/Stock: https://www.mouser.co.uk/ProductDetail/Vishay-Dale/CRCW0603121RFKEAHP?qs=40TFAHZMFvf7JpHs6aBGEg%3D%3D; Arrow Part Number: CRCW0603121RFKEAHP; Arrow Price/Stock: https://www.arrow.com/en/products/crcw0603121rfkeahp/vishay?region=nac
R41 = CRCW06031K20FKEAHP: Resistor; Manufacturer_Name: Vishay; Datasheet Link: https://www.vishay.com/docs/20043/crcwhpe3.pdf; Height: 0.55mm; Manufacturer_Part_Number: CRCW06031K20FKEAHP; Mouser Part Number: 71-CRCW06031K20FKEAH; Mouser Price/Stock: https://www.mouser.co.uk/ProductDetail/Vishay-Dale/CRCW06031K20FKEAHP?qs=40TFAHZMFveP9B2Fb67Ndg%3D%3D; Arrow Part Number: CRCW06031K20FKEAHP; Arrow Price/Stock: https://www.arrow.com/en/products/crcw06031k20fkeahp/vishay?region=nac
SW2 = CMP-10038-000020-1: SWITCH SLIDE SPST 4A 125V; Actuator Length: 5.08mm; Actuator Type: Standard; Contact Current Rating: 2A; Electrical Life: 10000Cycles; Switch Function: On-Off; Voltage Rating (DC): 28V; Actuator Color: Black; Actuator Material: Nylon; Switch Travel: 3.81mm; Max Voltage Rating (AC): 250V; Max Current Rating: 4A; Contact Plating: Silver; Throw Configuration: SPST; Depth: 10.8mm; Package Quantity: 1; Length: 19.1mm; Current Rating: 4A; Max Operating Temperature: 65°C; Orientation: Straight; Radiation Hardening: No; Termination: PC Pins; Max Voltage Rating (DC): 125V; Series: L; Min Operating Temperature: -30°C; Contact Material: Copper; Lead Free: Lead Free; Mount: Through Hole; RoHS Compliant: Yes; Voltage Rating (AC): 125V; Packaging: Bulk; Housing Material: Nylon
T1 = CMP-1360-00010-2: NexarPartId: 19122558; Input Current: 100A; Max DC Current: 2.5A; Inductance: 500µH; Output Voltage: 15V; Output Current: 3A; Isolation Voltage: 2.5kV; Max Input Voltage: 400V; Turns Ratio: 6:1; DC Resistance (DCR): 17mΩ; Frequency: 400kHz; Output Power: 45W; Min Input Voltage: 100V; Min Operating Temperature: -40°C; Packaging: Digi-Reel®; Height: 13.69mm; Termination: SMD/SMT; Max Operating Temperature: 125°C; Height - Seated (Max): 13.69mm; Mount: Surface Mount; RoHS: Compliant; Current Rating: 2.5A; Depth: 13.69mm; Length: 27.03mm; Width: 32.31mm; Max Switching Frequency: 400kHz; REACH SVHC: No SVHC
U2 = 85300001009: Undefined or Miscellaneous; Manufacturer_Name: LITTELFUSE; Datasheet Link: https://www.digikey.ph/en/products/detail/littelfuse-inc/85300001009/653461; Height: 32.9mm; Manufacturer_Part_Number: 85300001009; Mouser Part Number: 576-85300001009; Mouser Price/Stock: https://www.mouser.co.uk/ProductDetail/Littelfuse/85300001009?qs=ImUY93axo1htCnreTZ0QOw%3D%3D; Arrow Part Number: 85300001009; Arrow Price/Stock: https://www.arrow.com/en/products/85300001009/littelfuse
U3 = CMP-0491-01149-1: Isolated No Opto-Coupler Flyback Controller with Active PFC, 16-pin SOP (MSE-16-EDP), -40 to 125 degC, Pb-Free; Manufacturer: Linear Technology; Number of Outputs: 1; PackageDescription: 16-Pin Plastic MSOP, Exposed Die Pad, Body 4.039 x 3 mm, Pitch 0.5 mm; ComponentLink2URL: http://cds.linear.com/docs/en/datasheet/3798fa.pdf; ComponentLink3Description: Package Specification; PackageReference: MSE-16; PartNumber: LT3798EMSE#PBF; DatasheetVersion: Rev. A; RoHS: TRUE; ComponentLink2Description: Datasheet; PackageVersion: Rev. F, 05/2013; ComponentLink3URL: http://cds.linear.com/docs/en/packaging/05081667_F_MSE16.pdf; Mounting Technology: Surface Mount; ComponentLink1URL: http://www.linear.com/; ComponentLink1Description: Manufacturer URL
U4 = CMP-0062-00598-5: 3A Low Dropout Positive Regulators, 3-pin TO-263, Pb-Free; Manufacturer: Texas Instruments; PackageTopMarking: NSUZXYTTE#*LM1085*IS-ADJ; CompType: LDO IC; PowerWise: N; High-Reliability: Y; Code_JEDEC: MO-169-AA; PackageDescription: TO-263, Molded, .400 x .390 x .180in, 3 Lead, .1in Pitch, Surface Mount; ComponentLink1Description: Datasheet URL; PinCount: 3; PackageReference: KTT0003B; ComponentLink1URL: http://www.ti.com/general/docs/lit/getliterature.tsp?genericPartNumber=LM1085&fileType=pdf; PartNumber: LM1085ISX-ADJ/NOPB; RoHS: Y
U5 = CMP-1679-00010-1: Low-Dropout Positive Fixed Voltage Regulator, 1 A, 3.3 V Output Voltage, 0 to 125 degC, 4-Pin SOT-223 (318H-01), Pb-Free, Tape and Reel; Resistance: 220 kohm; Type (Resistor): Thick Film; Voltage Rating: 75 V; Tolerance: 1%; Case\Package: 0603; Power Rating: 100 mW; Width: 0.85 mm; Weight: 7.1E-05 oz; ComponentLink2URL: http://www.onsemi.com/pub_link/Collateral/NCP1117-D.PDF; RoHSCompliant: true; Height: 0.45 mm; PackageDescription: 4-Pin Small Outline Transistor, Body 6.5 x 3.5 mm, Pitch 2.3 mm; ComponentLink1Description: Manufacturer URL; ComponentLink1URL: http://www.onsemi.com/; PackageReference: SOT-223-4-318H-01_A; Max Operating Temperature: 155 degC; Packaging: Tape and Reel; REACH SVHC: Unknown; Length: 1.55 mm; Package Quantity: 5000; Radiation Hardening: No; Min Operating Temperature: -55 degC; DatasheetVersion: Rev. 27, 09/2014; Mount: Surface Mount; Case Code (Imperial): 0603; Case Code (Metric): 1608; ComponentLink2Description: Datasheet